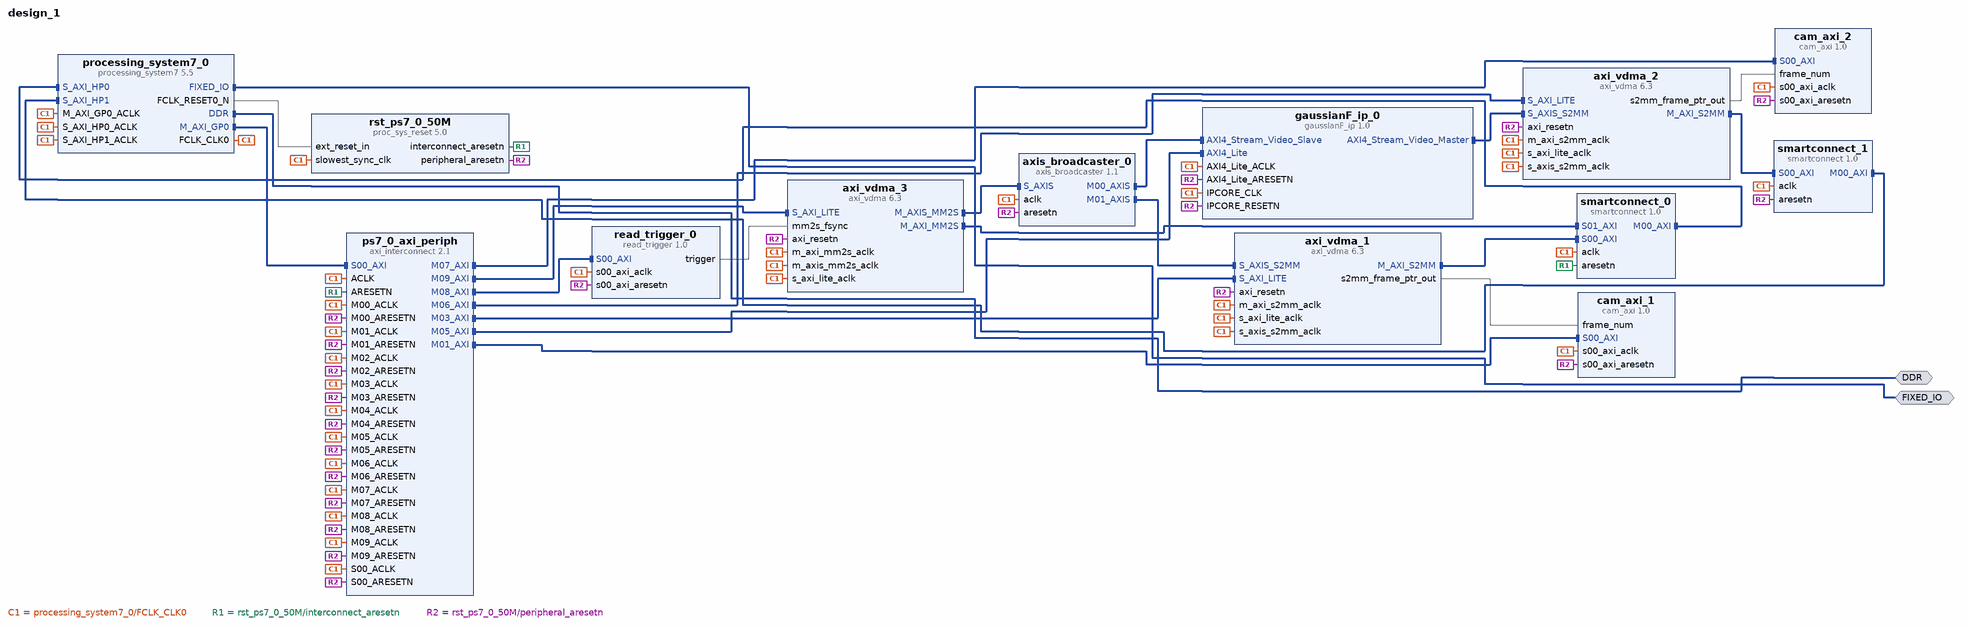
[diagram p0: block diagram of the top level]
# Vivado block design design_1, xc7z020clg400-3, Vivado 2019.1
create_bd_design design_1

create_bd_intf_port -mode Master -vlnv xilinx.com:interface:ddrx_rtl:1.0 DDR
create_bd_intf_port -mode Master -vlnv xilinx.com:display_processing_system7:fixedio_rtl:1.0 FIXED_IO

create_bd_cell -type ip -vlnv xilinx.com:ip:axi_vdma:6.3 axi_vdma_1
set_property -dict [list \
  CONFIG.c_enable_vert_flip 0 \
  CONFIG.c_include_mm2s 0 \
  CONFIG.c_s2mm_genlock_mode 0 \
  CONFIG.c_s2mm_linebuffer_depth 128 \
  CONFIG.c_s2mm_max_burst_length 256 \
  CONFIG.c_use_s2mm_fsync 2 \
] [get_bd_cells axi_vdma_1]
create_bd_cell -type ip -vlnv xilinx.com:ip:axi_vdma:6.3 axi_vdma_2
set_property -dict [list \
  CONFIG.c_enable_vert_flip 0 \
  CONFIG.c_include_mm2s 0 \
  CONFIG.c_num_fstores 3 \
  CONFIG.c_s2mm_genlock_mode 0 \
  CONFIG.c_s2mm_linebuffer_depth 128 \
  CONFIG.c_s2mm_max_burst_length 256 \
  CONFIG.c_use_s2mm_fsync 2 \
] [get_bd_cells axi_vdma_2]
create_bd_cell -type ip -vlnv xilinx.com:ip:axi_vdma:6.3 axi_vdma_3
set_property -dict [list \
  CONFIG.c_include_mm2s 1 \
  CONFIG.c_include_s2mm 0 \
  CONFIG.c_m_axis_mm2s_tdata_width 64 \
  CONFIG.c_mm2s_genlock_mode 0 \
  CONFIG.c_mm2s_linebuffer_depth 128 \
  CONFIG.c_mm2s_max_burst_length 256 \
  CONFIG.c_num_fstores 1 \
  CONFIG.c_use_mm2s_fsync 1 \
] [get_bd_cells axi_vdma_3]
create_bd_cell -type ip -vlnv xilinx.com:ip:axis_broadcaster:1.1 axis_broadcaster_0
create_bd_cell -type ip -vlnv xilinx.com:user:cam_axi:1.0 cam_axi_1
create_bd_cell -type ip -vlnv xilinx.com:user:cam_axi:1.0 cam_axi_2
create_bd_cell -type ip -vlnv xilinx.com:ip:processing_system7:5.5 processing_system7_0
set_property -dict [list \
  CONFIG.PCW_APU_PERIPHERAL_FREQMHZ 667 \
  CONFIG.PCW_CPU_CPU_6X4X_MAX_RANGE 867 \
  CONFIG.PCW_ENET0_PERIPHERAL_ENABLE 0 \
  CONFIG.PCW_FPGA0_PERIPHERAL_FREQMHZ 50 \
  CONFIG.PCW_FPGA1_PERIPHERAL_FREQMHZ 10 \
  CONFIG.PCW_FPGA2_PERIPHERAL_FREQMHZ 10 \
  CONFIG.PCW_FPGA3_PERIPHERAL_FREQMHZ 10 \
  CONFIG.PCW_GPIO_EMIO_GPIO_ENABLE 1 \
  CONFIG.PCW_GPIO_EMIO_GPIO_IO 64 \
  CONFIG.PCW_GPIO_MIO_GPIO_ENABLE 1 \
  CONFIG.PCW_GPIO_MIO_GPIO_IO MIO \
  CONFIG.PCW_GPIO_PERIPHERAL_ENABLE 1 \
  CONFIG.PCW_I2C0_I2C0_IO EMIO \
  CONFIG.PCW_I2C0_PERIPHERAL_ENABLE 1 \
  CONFIG.PCW_I2C1_I2C1_IO EMIO \
  CONFIG.PCW_I2C1_PERIPHERAL_ENABLE 1 \
  CONFIG.PCW_I2C_PERIPHERAL_FREQMHZ 111.111115 \
  CONFIG.PCW_I2C_RESET_ENABLE 1 \
  CONFIG.PCW_I2C_RESET_SELECT {Share reset pin} \
  CONFIG.PCW_IRQ_F2P_INTR 1 \
  CONFIG.PCW_PERIPHERAL_BOARD_PRESET part0 \
  CONFIG.PCW_PRESET_BANK0_VOLTAGE {LVCMOS 1.8V} \
  CONFIG.PCW_PRESET_BANK1_VOLTAGE {LVCMOS 1.8V} \
  CONFIG.PCW_QSPI_GRP_FBCLK_ENABLE 1 \
  CONFIG.PCW_QSPI_GRP_FBCLK_IO {MIO 8} \
  CONFIG.PCW_QSPI_GRP_SINGLE_SS_ENABLE 1 \
  CONFIG.PCW_QSPI_GRP_SINGLE_SS_IO {MIO 1 .. 6} \
  CONFIG.PCW_QSPI_PERIPHERAL_ENABLE 1 \
  CONFIG.PCW_QSPI_QSPI_IO {MIO 1 .. 6} \
  CONFIG.PCW_SD0_GRP_CD_ENABLE 0 \
  CONFIG.PCW_SD0_GRP_WP_ENABLE 0 \
  CONFIG.PCW_SD0_PERIPHERAL_ENABLE 1 \
  CONFIG.PCW_SD0_SD0_IO {MIO 40 .. 45} \
  CONFIG.PCW_SD1_PERIPHERAL_ENABLE 1 \
  CONFIG.PCW_SD1_SD1_IO {MIO 10 .. 15} \
  CONFIG.PCW_SDIO_PERIPHERAL_FREQMHZ 100 \
  CONFIG.PCW_SINGLE_QSPI_DATA_MODE x4 \
  CONFIG.PCW_SPI1_PERIPHERAL_ENABLE 1 \
  CONFIG.PCW_SPI1_SPI1_IO {MIO 46 .. 51} \
  CONFIG.PCW_UART0_PERIPHERAL_ENABLE 1 \
  CONFIG.PCW_UART0_UART0_IO {MIO 50 .. 51} \
  CONFIG.PCW_UART1_PERIPHERAL_ENABLE 0 \
  CONFIG.PCW_UART_PERIPHERAL_FREQMHZ 50 \
  CONFIG.PCW_UIPARAM_DDR_FREQ_MHZ 400 \
  CONFIG.PCW_UIPARAM_DDR_MEMORY_TYPE {LPDDR 2} \
  CONFIG.PCW_UIPARAM_DDR_PARTNO Custom \
  CONFIG.PCW_USB0_PERIPHERAL_ENABLE 0 \
  CONFIG.PCW_USB_RESET_ENABLE 1 \
  CONFIG.PCW_USE_FABRIC_INTERRUPT 1 \
  CONFIG.PCW_USE_S_AXI_HP0 1 \
  CONFIG.PCW_USE_S_AXI_HP1 1 \
] [get_bd_cells processing_system7_0]
# 512 more settings of processing_system7_0 are not shown: defaults, MIO pin electricals, DDR timing, and values the tool derives
create_bd_cell -type ip -vlnv xilinx.com:ip:axi_interconnect:2.1 ps7_0_axi_periph
set_property -dict [list \
  CONFIG.NUM_MI 10 \
  CONFIG.NUM_SI 1 \
  CONFIG.STRATEGY 1 \
  CONFIG.SYNCHRONIZATION_STAGES 2 \
] [get_bd_cells ps7_0_axi_periph]
create_bd_cell -type ip -vlnv xilinx.com:user:read_trigger:1.0 read_trigger_0
create_bd_cell -type ip -vlnv xilinx.com:ip:proc_sys_reset:5.0 rst_ps7_0_50M
create_bd_cell -type ip -vlnv xilinx.com:ip:smartconnect:1.0 smartconnect_0
set_property -dict {CONFIG.NUM_SI 2} [get_bd_cells smartconnect_0]
create_bd_cell -type ip -vlnv xilinx.com:ip:smartconnect:1.0 smartconnect_1
set_property -dict {CONFIG.NUM_SI 1} [get_bd_cells smartconnect_1]
create_bd_cell -type ip -vlnv xilinx.com:ip:gaussianF_ip:1.0 gaussianF_ip_0

# ---- connections ----

connect_bd_intf_net -intf_net cams_M_AXI_S2MM [get_bd_intf_pins processing_system7_0/S_AXI_HP0] [get_bd_intf_pins smartconnect_0/M00_AXI]
connect_bd_intf_net [get_bd_intf_pins axi_vdma_2/M_AXI_S2MM] [get_bd_intf_pins smartconnect_1/S00_AXI]
connect_bd_intf_net [get_bd_intf_ports FIXED_IO] [get_bd_intf_pins processing_system7_0/FIXED_IO]
connect_bd_intf_net [get_bd_intf_pins processing_system7_0/M_AXI_GP0] [get_bd_intf_pins ps7_0_axi_periph/S00_AXI]
connect_bd_intf_net [get_bd_intf_pins axi_vdma_1/S_AXI_LITE] [get_bd_intf_pins ps7_0_axi_periph/M03_AXI]
connect_bd_intf_net [get_bd_intf_pins axi_vdma_3/M_AXIS_MM2S] [get_bd_intf_pins axis_broadcaster_0/S_AXIS]
connect_bd_intf_net [get_bd_intf_pins axi_vdma_3/S_AXI_LITE] [get_bd_intf_pins ps7_0_axi_periph/M09_AXI]
connect_bd_intf_net [get_bd_intf_ports DDR] [get_bd_intf_pins processing_system7_0/DDR]
connect_bd_intf_net [get_bd_intf_pins axi_vdma_1/M_AXI_S2MM] [get_bd_intf_pins smartconnect_0/S00_AXI]
connect_bd_intf_net [get_bd_intf_pins ps7_0_axi_periph/M08_AXI] [get_bd_intf_pins read_trigger_0/S00_AXI]
connect_bd_intf_net [get_bd_intf_pins cam_axi_2/S00_AXI] [get_bd_intf_pins ps7_0_axi_periph/M07_AXI]
connect_bd_intf_net -intf_net stereo_M01_AXIS [get_bd_intf_pins axi_vdma_1/S_AXIS_S2MM] [get_bd_intf_pins axis_broadcaster_0/M01_AXIS]
connect_bd_intf_net [get_bd_intf_pins cam_axi_1/S00_AXI] [get_bd_intf_pins ps7_0_axi_periph/M01_AXI]
connect_bd_intf_net -intf_net stereo_M_AXI_MM2S [get_bd_intf_pins axi_vdma_3/M_AXI_MM2S] [get_bd_intf_pins smartconnect_0/S01_AXI]
connect_bd_intf_net [get_bd_intf_pins axi_vdma_2/S_AXI_LITE] [get_bd_intf_pins ps7_0_axi_periph/M06_AXI]
connect_bd_intf_net -intf_net stereo_M_AXI_S2MM [get_bd_intf_pins processing_system7_0/S_AXI_HP1] [get_bd_intf_pins smartconnect_1/M00_AXI]
connect_bd_intf_net [get_bd_intf_pins gaussianF_ip_0/AXI4_Lite] [get_bd_intf_pins ps7_0_axi_periph/M05_AXI]
connect_bd_intf_net [get_bd_intf_pins gaussianF_ip_0/AXI4_Stream_Video_Master] [get_bd_intf_pins axi_vdma_2/S_AXIS_S2MM]
connect_bd_intf_net [get_bd_intf_pins gaussianF_ip_0/AXI4_Stream_Video_Slave] [get_bd_intf_pins axis_broadcaster_0/M00_AXIS]
connect_bd_net -net axi_vdma_0_s2mm_frame_ptr_out_1 [get_bd_pins axi_vdma_1/s2mm_frame_ptr_out] [get_bd_pins cam_axi_1/frame_num]
connect_bd_net -net axi_vdma_1_s2mm_frame_ptr_out [get_bd_pins axi_vdma_2/s2mm_frame_ptr_out] [get_bd_pins cam_axi_2/frame_num]
connect_bd_net [get_bd_pins processing_system7_0/FCLK_CLK0] \
  [get_bd_pins axi_vdma_1/m_axi_s2mm_aclk] [get_bd_pins axi_vdma_1/s_axi_lite_aclk] [get_bd_pins axi_vdma_1/s_axis_s2mm_aclk] \
  [get_bd_pins axi_vdma_2/m_axi_s2mm_aclk] [get_bd_pins axi_vdma_2/s_axi_lite_aclk] [get_bd_pins axi_vdma_2/s_axis_s2mm_aclk] \
  [get_bd_pins axi_vdma_3/m_axi_mm2s_aclk] [get_bd_pins axi_vdma_3/m_axis_mm2s_aclk] [get_bd_pins axi_vdma_3/s_axi_lite_aclk] \
  [get_bd_pins axis_broadcaster_0/aclk] [get_bd_pins cam_axi_1/s00_axi_aclk] [get_bd_pins cam_axi_2/s00_axi_aclk] \
  [get_bd_pins processing_system7_0/M_AXI_GP0_ACLK] [get_bd_pins processing_system7_0/S_AXI_HP0_ACLK] \
  [get_bd_pins processing_system7_0/S_AXI_HP1_ACLK] [get_bd_pins ps7_0_axi_periph/ACLK] \
  [get_bd_pins ps7_0_axi_periph/M00_ACLK] [get_bd_pins ps7_0_axi_periph/M01_ACLK] [get_bd_pins ps7_0_axi_periph/M02_ACLK] \
  [get_bd_pins ps7_0_axi_periph/M03_ACLK] [get_bd_pins ps7_0_axi_periph/M04_ACLK] [get_bd_pins ps7_0_axi_periph/M05_ACLK] \
  [get_bd_pins ps7_0_axi_periph/M06_ACLK] [get_bd_pins ps7_0_axi_periph/M07_ACLK] [get_bd_pins ps7_0_axi_periph/M08_ACLK] \
  [get_bd_pins ps7_0_axi_periph/M09_ACLK] [get_bd_pins ps7_0_axi_periph/S00_ACLK] [get_bd_pins read_trigger_0/s00_axi_aclk] \
  [get_bd_pins rst_ps7_0_50M/slowest_sync_clk] [get_bd_pins smartconnect_0/aclk] [get_bd_pins smartconnect_1/aclk] \
  [get_bd_pins gaussianF_ip_0/AXI4_Lite_ACLK] [get_bd_pins gaussianF_ip_0/IPCORE_CLK]
connect_bd_net [get_bd_pins processing_system7_0/FCLK_RESET0_N] [get_bd_pins rst_ps7_0_50M/ext_reset_in]
connect_bd_net [get_bd_pins read_trigger_0/trigger] [get_bd_pins axi_vdma_3/mm2s_fsync]
connect_bd_net [get_bd_pins rst_ps7_0_50M/interconnect_aresetn] [get_bd_pins ps7_0_axi_periph/ARESETN] [get_bd_pins smartconnect_0/aresetn]
connect_bd_net [get_bd_pins rst_ps7_0_50M/peripheral_aresetn] \
  [get_bd_pins axi_vdma_1/axi_resetn] [get_bd_pins axi_vdma_2/axi_resetn] [get_bd_pins axi_vdma_3/axi_resetn] \
  [get_bd_pins axis_broadcaster_0/aresetn] [get_bd_pins cam_axi_1/s00_axi_aresetn] [get_bd_pins cam_axi_2/s00_axi_aresetn] \
  [get_bd_pins ps7_0_axi_periph/M00_ARESETN] [get_bd_pins ps7_0_axi_periph/M01_ARESETN] \
  [get_bd_pins ps7_0_axi_periph/M02_ARESETN] [get_bd_pins ps7_0_axi_periph/M03_ARESETN] \
  [get_bd_pins ps7_0_axi_periph/M04_ARESETN] [get_bd_pins ps7_0_axi_periph/M05_ARESETN] \
  [get_bd_pins ps7_0_axi_periph/M06_ARESETN] [get_bd_pins ps7_0_axi_periph/M07_ARESETN] \
  [get_bd_pins ps7_0_axi_periph/M08_ARESETN] [get_bd_pins ps7_0_axi_periph/M09_ARESETN] \
  [get_bd_pins ps7_0_axi_periph/S00_ARESETN] [get_bd_pins read_trigger_0/s00_axi_aresetn] \
  [get_bd_pins smartconnect_1/aresetn] [get_bd_pins gaussianF_ip_0/AXI4_Lite_ARESETN] \
  [get_bd_pins gaussianF_ip_0/IPCORE_RESETN]

# ---- address map ----
assign_bd_address -offset 0x00000000 -range 1G -target_address_space [get_bd_addr_spaces axi_vdma_1/Data_S2MM] [get_bd_addr_segs processing_system7_0/S_AXI_HP0/HP0_DDR_LOWOCM]
assign_bd_address -offset 0x00000000 -range 1G -target_address_space [get_bd_addr_spaces axi_vdma_2/Data_S2MM] [get_bd_addr_segs processing_system7_0/S_AXI_HP1/HP1_DDR_LOWOCM]
assign_bd_address -offset 0x00000000 -range 1G -target_address_space [get_bd_addr_spaces axi_vdma_3/Data_MM2S] [get_bd_addr_segs processing_system7_0/S_AXI_HP0/HP0_DDR_LOWOCM]
assign_bd_address -offset 0x43000000 -range 64K -target_address_space [get_bd_addr_spaces processing_system7_0/Data] [get_bd_addr_segs axi_vdma_1/S_AXI_LITE/Reg]
assign_bd_address -offset 0x43010000 -range 64K -target_address_space [get_bd_addr_spaces processing_system7_0/Data] [get_bd_addr_segs axi_vdma_2/S_AXI_LITE/Reg]
assign_bd_address -offset 0x43020000 -range 64K -target_address_space [get_bd_addr_spaces processing_system7_0/Data] [get_bd_addr_segs axi_vdma_3/S_AXI_LITE/Reg]
assign_bd_address -offset 0x43C20000 -range 64K -target_address_space [get_bd_addr_spaces processing_system7_0/Data] [get_bd_addr_segs read_trigger_0/S00_AXI/S00_AXI_reg]
assign_bd_address -offset 0x43C30000 -range 64K -target_address_space [get_bd_addr_spaces processing_system7_0/Data] [get_bd_addr_segs cam_axi_2/S00_AXI/S00_AXI_reg]
assign_bd_address -offset 0x43C50000 -range 64K -target_address_space [get_bd_addr_spaces processing_system7_0/Data] [get_bd_addr_segs cam_axi_1/S00_AXI/S00_AXI_reg]
assign_bd_address -offset 0x43C60000 -range 64K -target_address_space [get_bd_addr_spaces processing_system7_0/Data] [get_bd_addr_segs gaussianF_ip_0/AXI4_Lite/reg0]

validate_bd_design
save_bd_design
